# EAGLE design ATX_Power_Breakout (EAGLE 8.5.2)
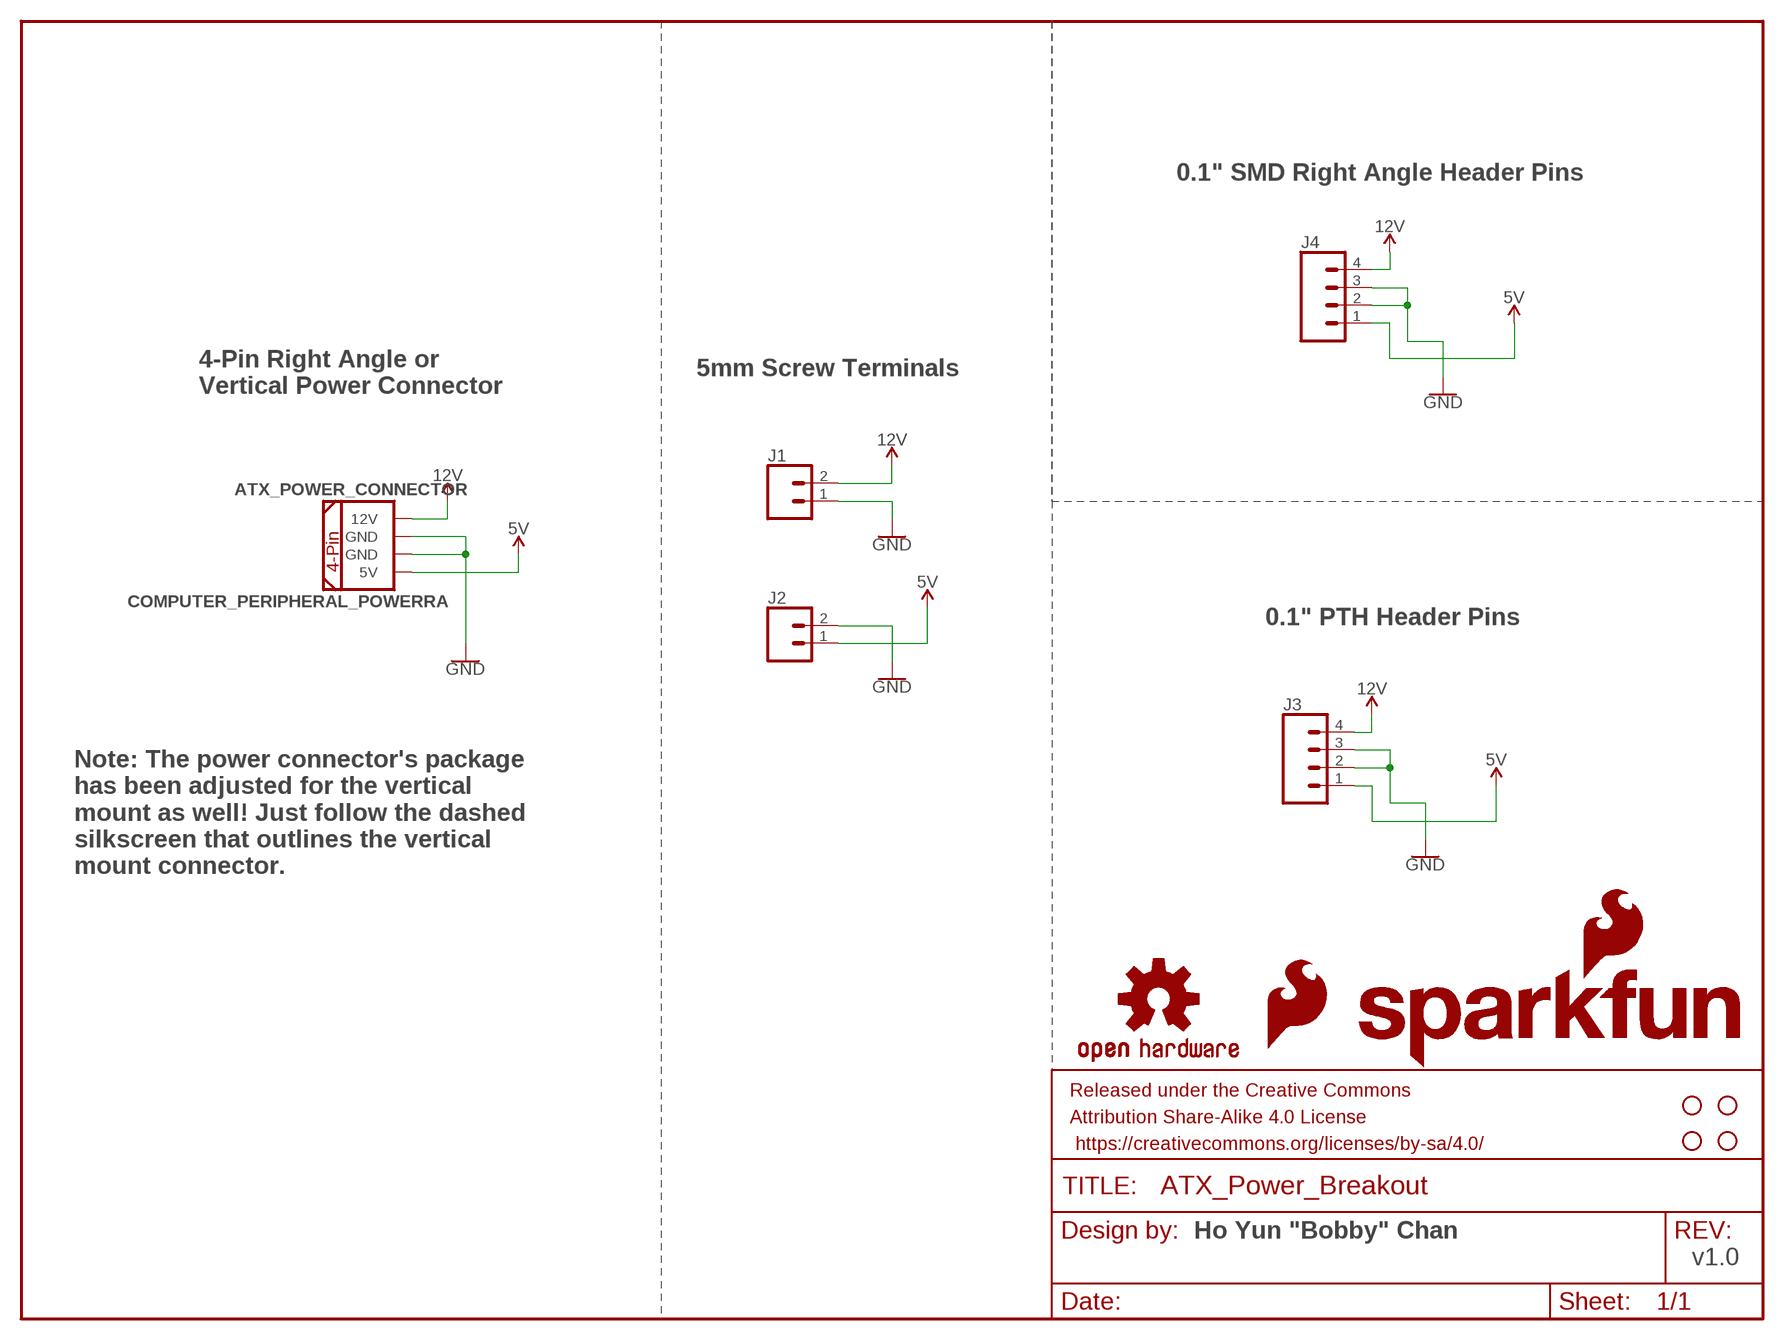
[diagram p0: schematic, sheet 1]

## Parts
ATX_POWER_CONNECTOR  COMPUTER_PERIPHERAL_POWERRA  [COMPUTER-PERIPHERAL-POWER-RA]
FRAME1  FRAME-LETTER  [CREATIVE_COMMONS]
H1  STAND-OFF  [STAND-OFF]
H2  STAND-OFF  [STAND-OFF]
H3  STAND-OFF  [STAND-OFF]
H4  STAND-OFF  [STAND-OFF]
J1  CONN_025MM  [SCREWTERMINAL-5MM-2]
J2  CONN_025MM  [SCREWTERMINAL-5MM-2]
J3  CONN_04  [1X04]
J4  CONN_04SMD  [1X04_SMD_RA_MALE]
LOGO1  OSHW-LOGOS  [OSHW-LOGO-S]
LOGO2  SFE_LOGO_NAME_FLAME.1_INCH  [SFE_LOGO_NAME_FLAME_.1]
LOGO3  SFE_LOGO_FLAME.1_INCH  [SFE_LOGO_FLAME_.1]

## Nets
5V: ATX_POWER_CONNECTOR.5V J2.1 J3.1 J4.1
12V: ATX_POWER_CONNECTOR.12V J1.2 J3.4 J4.4
GND: ATX_POWER_CONNECTOR.GND@1(GND) ATX_POWER_CONNECTOR.GND@2(GND) J1.1 J2.2 J3.2 J3.3 J4.2 J4.3

## Notes on the sheet
- 0.1" SMD Right Angle Header Pins
- 5mm Screw Terminals
- 4-Pin Right Angle or
  Vertical Power Connector
- 0.1" PTH Header Pins
- Note: The power connector's package
  has been adjusted for the vertical 
  mount as well! Just follow the dashed 
  silkscreen that outlines the vertical 
  mount connector.
- Ho Yun "Bobby" Chan
- v1.0

## Library data of the parts
ATX_POWER_CONNECTOR = SparkFun-Retired:COMPUTER_PERIPHERAL_POWER
FRAME1 = SparkFun-Aesthetics:FRAME-LETTER: Schematic Frame - Letter Standard 8.5x11 US Letter frame
H1-H4 = SparkFun-Hardware:STAND-OFF: Stand Off Drill holes for mechanically mounting via screws, standoffs, etc. Note: Use the keepout ring to avoid running the screw head into surrounding components. Variant Overviews STAND-OFF - Mechanical footprint for a #4 phillips button head screw. STAND-OFF-TIGHT - Mechanical footprint for a #4 phillips button head screw, Example SparkFun Products Screw - Phillips Head (1/4", 4-40, 10 pack) <https://www.sparkfun.com/products/10453> (PRT-10453) Screw - Phillips Head (1/2", 4-40, 10 pack) <https://www.sparkfun.com/products/10452> (PRT-10452) Screw - Phillips Head (3/4", 4-40, 10 pack) <https://www.sparkfun.com/products/10451> (PRT-10451) Screw - Phillips Head (1", 4-40, 10 pack) <https://www.sparkfun.com/products/10450> (PRT-10450)
J1 J2 = SparkFun-Connectors:CONN_02: Multi connection point. Often used as Generic Header-pin footprint for 0.1 inch spaced/style header connections On any of the 0.1 inch spaced packages, you can populate with these: Break Away Headers - Straight <https://www.sparkfun.com/products/116> (PRT-00116) Break Away Male Headers - Right Angle <https://www.sparkfun.com/products/553> (PRT-00553) Female Headers <https://www.sparkfun.com/products/115> (PRT-00115) Break Away Headers - Machine Pin <https://www.sparkfun.com/products/117> (PRT-00117) Break Away Female Headers - Swiss Machine Pin <https://www.sparkfun.com/products/743> (PRT-00743) For SCREWTERMINALS and SPRING TERMINALS visit here: Screw Terimnals on SparkFun.com <https://www.sparkfun.com/search/results?term=Screw+Terminals> (5mm/3.5mm/2.54mm spacing) This device is also useful as a general connection point to wire up your design to another part of your project. Our various solder wires solder well into these plated through hole pads. Hook-Up Wire - Assortment (Stranded, 22 AWG) <https://www.sparkfun.com/products/11375> (PRT-11375) Hook-Up Wire - Assortment (Solid Core, 22 AWG) <https://www.sparkfun.com/products/11367> (PRT-11367) View the entire wire category on our website here <https://www.sparkfun.com/categories/141> Special notes: Molex polarized connector foot print use with: PRT-08233 with associated crimp pins and housings. 2.54_SCREWTERM for use with PRT-10571. 3.5mm Screw Terminal footprints for PRT-08084 5mm Screw Terminal footprints for use with PRT-08432; SF_SKU: PRT-08432
J3 = SparkFun-Connectors:CONN_04: Multi connection point. Often used as Generic Header-pin footprint for 0.1 inch spaced/style header connections On any of the 0.1 inch spaced packages, you can populate with these: Break Away Headers - Straight <https://www.sparkfun.com/products/116> (PRT-00116) Break Away Male Headers - Right Angle <https://www.sparkfun.com/products/553> (PRT-00553) Female Headers <https://www.sparkfun.com/products/115> (PRT-00115) Break Away Headers - Machine Pin <https://www.sparkfun.com/products/117> (PRT-00117) Break Away Female Headers - Swiss Machine Pin <https://www.sparkfun.com/products/743> (PRT-00743) For SCREWTERMINALS and SPRING TERMINALS visit here: Screw Terimnals on SparkFun.com <https://www.sparkfun.com/search/results?term=Screw+Terminals> (5mm/3.5mm/2.54mm spacing) This device is also useful as a general connection point to wire up your design to another part of your project. Our various solder wires solder well into these plated through hole pads. Hook-Up Wire - Assortment (Stranded, 22 AWG) <https://www.sparkfun.com/products/11375> (PRT-11375) Hook-Up Wire - Assortment (Solid Core, 22 AWG) <https://www.sparkfun.com/products/11367> (PRT-11367) View the entire wire category on our website here <https://www.sparkfun.com/categories/141> Special notes: Molex polarized connector foot print use with SKU : PRT-08231 with associated crimp pins and housings. 1MM SMD Version SKU: PRT-10208; PROD_ID: CONN-09696
J4 = SparkFun-Connectors:CONN_04: Multi connection point. Often used as Generic Header-pin footprint for 0.1 inch spaced/style header connections On any of the 0.1 inch spaced packages, you can populate with these: Break Away Headers - Straight <https://www.sparkfun.com/products/116> (PRT-00116) Break Away Male Headers - Right Angle <https://www.sparkfun.com/products/553> (PRT-00553) Female Headers <https://www.sparkfun.com/products/115> (PRT-00115) Break Away Headers - Machine Pin <https://www.sparkfun.com/products/117> (PRT-00117) Break Away Female Headers - Swiss Machine Pin <https://www.sparkfun.com/products/743> (PRT-00743) For SCREWTERMINALS and SPRING TERMINALS visit here: Screw Terimnals on SparkFun.com <https://www.sparkfun.com/search/results?term=Screw+Terminals> (5mm/3.5mm/2.54mm spacing) This device is also useful as a general connection point to wire up your design to another part of your project. Our various solder wires solder well into these plated through hole pads. Hook-Up Wire - Assortment (Stranded, 22 AWG) <https://www.sparkfun.com/products/11375> (PRT-11375) Hook-Up Wire - Assortment (Solid Core, 22 AWG) <https://www.sparkfun.com/products/11367> (PRT-11367) View the entire wire category on our website here <https://www.sparkfun.com/categories/141> Special notes: Molex polarized connector foot print use with SKU : PRT-08231 with associated crimp pins and housings. 1MM SMD Version SKU: PRT-10208; PROD_ID: CONN-09140; SF_ID: PRT-12638
LOGO1 = SparkFun-Aesthetics:OSHW-LOGO: Open-Source Hardware (OSHW) Logo This logo indicates the piece of hardware it is found on incorporates a OSHW license and/or adheres to the definition of open source hardware found here: http://freedomdefined.org/OSHW
LOGO2 = SparkFun-Aesthetics:SFE_LOGO_NAME_FLAME: SparkFun Font Logo w/ Flame This is the SparkFun full logo. The logo on the schematic will always be the same size; the package variant is the height of the flame part of the logo. Default layer for the logo on the board is tSilk.
LOGO3 = SparkFun-Aesthetics:SFE_LOGO_FLAME: SparkFun Flame Logo This is the SparkFun flame logo. The logo on the schematic will always be the same size; the package variant is the height of the flame. Default layer for the logo on the board is tSilk.

## Board
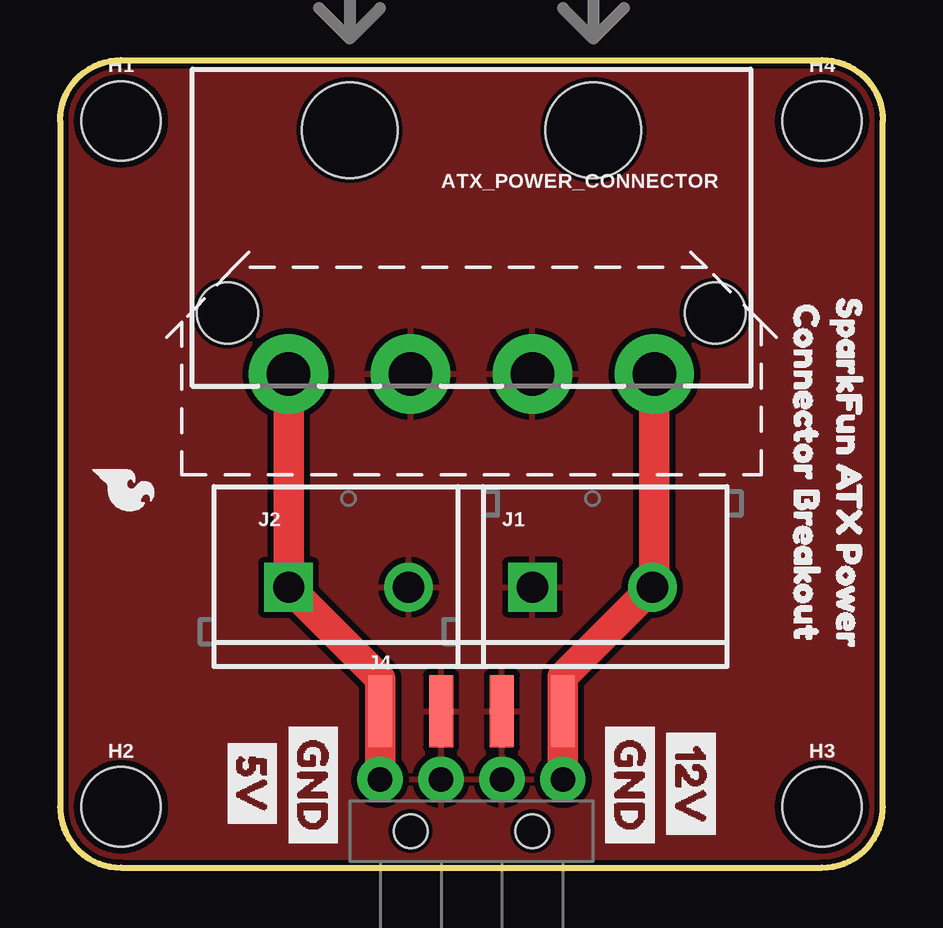
[diagram p1: board, top side]
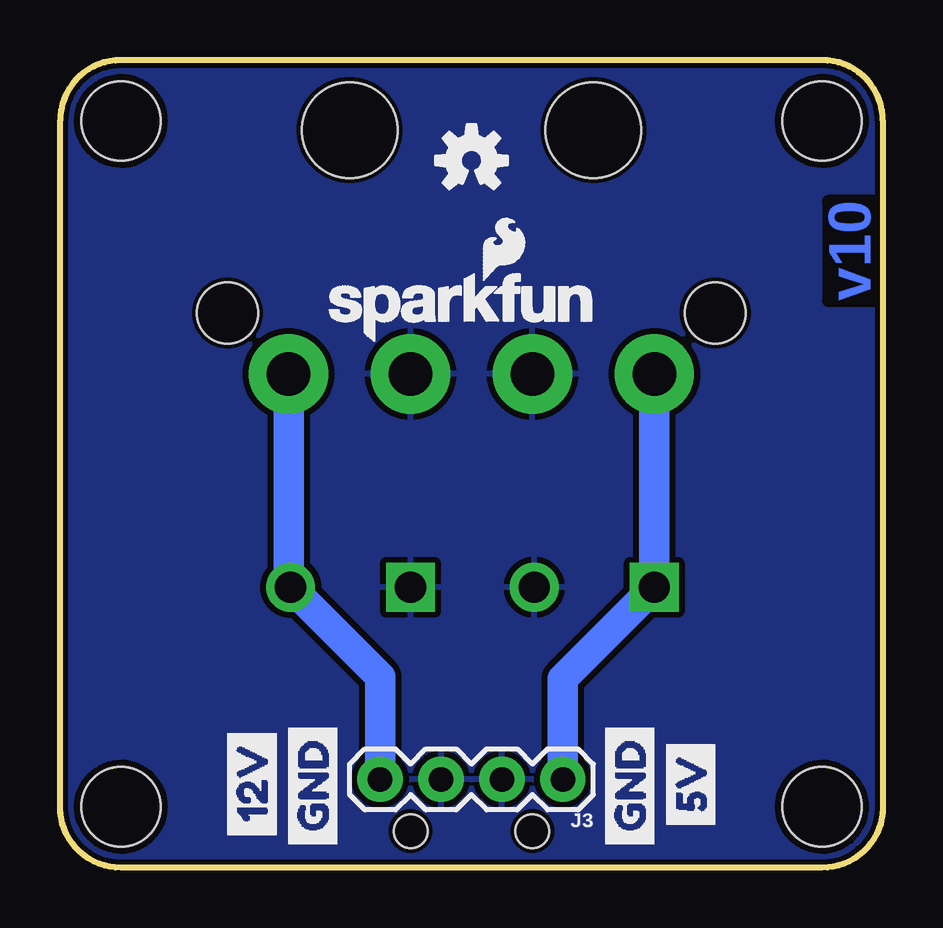
[diagram p2: board, bottom side, seen from below]

Size 34.29 x 33.66 mm. Coordinates in mm from the lower left corner, seen from the top.
Outline: 0,31.11 0,2.54 arc90 2.54,0 31.75,0 arc90 34.29,2.54 34.29,31.11 arc90 31.75,33.66 2.54,33.66 arc90 0,31.11
Copper layers (1*16): Top 0.035mm / dielectric 1.5mm / Bottom 0.035mm
Design rules "SparkFun-2-layer-STANDARD": minimum track width 10mil, minimum drill 20mil, track to track 10mil, track to pad 8mil, pad to pad 8mil, via to via 10mil, smd to smd 8mil, copper to edge 8mil, drill to drill 8mil, minimum pad ring 10mil, minimum via ring 10mil, stop-mask expansion 4mil, vias tented up to drill 25mil, thermal gap 10mil

### Footprints (pad centres in the part's own frame; a part is rotated, then mirrored left to right if it is on the bottom)
COMPUTER-PERIPHERAL-POWER-RA = drill 1.82 pad 3.302: 5V -7.62,-2.54; 12V 7.62,-2.54; GND@1 -2.54,-2.54; GND@2 2.54,-2.54 | hole 2.54: -10.16,0; 10.16,0 | hole 3.988: -5.08,7.62; 5.08,7.62
STAND-OFF = hole 3.302: 0,0
SCREWTERMINAL-5MM-2 = drill 1.3 pad 2.032 square: 1 0,0 | drill 1.3 pad 2.032: 2 5,0
1X04 = drill 1.016 pad 1.88: 1 0,0; 2 2.54,0; 3 5.08,0; 4 7.62,0
1X04_SMD_RA_MALE = smd 1 x 3: 1 -3.81,5; 2 -1.27,5; 3 1.27,5; 4 3.81,5 | hole 1.4: -2.54,0; 2.54,0

### Placement (x,y rotation side)
ATX_POWER_CONNECTOR  17.14,23.11 0 top
FRAME1  -17.78,-23.5 0 top  (outside the outline)
H1  2.54,31.11 0 top
H2  2.54,2.54 0 top
H3  31.75,2.54 0 top
H4  31.75,31.11 0 top
J1  19.68,11.68 0 top
J2  9.53,11.68 0 top
J3  13.34,3.68 180 bottom
J4  17.14,1.52 0 top
LOGO1  17.14,29.46 0 bottom
LOGO2  23.5,21.84 0 bottom
LOGO3  1.02,16.89 270 top
U$1  [12V0]  26.29,6.22 270 top
U$2  [5V0]  8,5.84 270 top
U$3  [GND0]  10.54,6.48 270 top
U$4  [GND0]  23.75,6.48 270 top
U$5  [12V0]  26.29,0.76 90 bottom
U$6  [GND0]  23.75,0.38 90 bottom
U$7  [GND0]  10.54,0.38 90 bottom
U$8  [5V0]  8,1.14 90 bottom
U$9  [SPARKFUN_ATX_POWER0]  32.89,24.64 270 top
U$10  [CONNECTOR_BREAKOUT0]  31.11,24.38 270 top

### Tracks (layer width: path | path; a pad name or v marks a point on that pad's centre or on a via)
5V
  Top 1.27: ATX_POWER_CONNECTOR.5V J2.1 13.34,7.87 J4.1 J3.1
  Bottom 1.27: J3.1 13.34,7.87 J2.1 9.53,20.7
12V
  Top 1.27: ATX_POWER_CONNECTOR.12V 24.77,11.76 J1.2 20.95,7.95 J4.4 J3.4
  Bottom 1.27: J3.4 20.95,7.95 J1.2 | ATX_POWER_CONNECTOR.12V 24.77,11.81 24.64,11.68
GND
  pour Bottom: 31.75,0 2.54,0 arc-90 0,2.54 0,31.11 arc-90 2.54,33.66 31.75,33.66 arc-90 34.29,31.11 34.29,2.54 arc-90
  pour Top: 2.54,0 31.75,0 arc90 34.29,2.54 34.29,31.11 arc90 31.75,33.66 2.54,33.66 arc90 0,31.11 0,2.54 arc90

### Text on the board
Bottom: v10
Measures: Dimensions given are in inches.
tDocu: Ho Yun "Bobby" Chan